# Altium schematic sheet Probe.SchDoc: JDH Productions Probe Board
size B; Author: JWH; DrawnBy: JWH; Engineer: JWH; Revision: 1; SheetNumber: 1; SheetTotal: 1
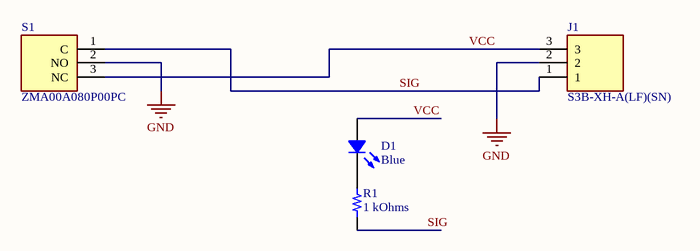
[diagram p0: Probe.SchDoc]

## Parts
D1  Blue  [LED 0805_2012 BLUE]
J1  S3B-XH-A(LF)(SN)  [JST_S3B-XH-A(LF)(SN)]
R1  1 kOhms  [RES 0805_2012]
S1  ZMA00A080P00PC  [ZMA00A080P00PC]

## Nets
GND: J1.2 S1.2(NO)
SIG: J1.1 R1.1 S1.1(C)
VCC: D1.1 J1.3 S1.3(NC)
NetD1_2: D1.2 R1.2

## Library data of the parts
D1 = 5990191007F: LED BLUE 0805 SMD; Manufacturer: Dialight; Configuration: Standard; Current - Test: 20mA; Lens Color: 0.80mm; Lens Size: 1.40mm x 1.25mm; Lens Style: Rectangle with Flat Top; Millicandela Rating: 105mcd; Viewing Angle: 140°; Voltage - Forward (Vf) (Typ): 3.2V; Wavelength - Dominant: 470nm; Part Number: 5990191007F; Color: Blue; ComponentLink1Description: Datasheet; ComponentLink1URL: http://www.dialightsignalsandcomponents.com/Assets/Brochures_And_Catalogs/Indication/CBI_SMD_new/Dialight_CBI_data_599-0805_Apr2018.pdf; ComponentLink2Description: DigiKey Link; ComponentLink2URL: https://www.digikey.com/en/products/detail/dialight/5990191007F/9385414; Device Package: 0805 (2012 Metric); Height (Max): 0.80mm; LastUpdated: 4/12/2022 10:51:43 PM; Lifecycle Status: Active; Minimum Order: 1; Mounting Type: Surface Mount; Package / Case: 0805 (2012 Metric); Packaging: TapeAndReel; PartId: 759; Part Status: Active; Price: 0.09; Series: 599; Size / Dimension: 2.00mm L x 1.25mm W; Supplier 1: DigiKey; Supplier Part Number 1: 350-4359-1-ND; Supplier Device Package: 0805; Value: Blue
J1 = S3B-XH-A(LF)(SN): Connector Header Through Hole, Right Angle 3 position 0.098" (2.50mm); MF: {'manufacturer': u'JST Sales America Inc.'}; Availability: Unavailable; MP: S3B-XH-A(LF)(SN); Value: *; Package: None; Price: None
R1 = RNCP0805FTD1K00: RES 1K OHM 1% 1/4W 0805; Manufacturer: Stackpole Electronics Inc; Power (Watts): 0.25W, 1/4W; Temperature Coefficient: ±100ppm/°C; Part Number: RNCP0805FTD1K00; Value: 1 kOhms; ComponentLink1Description: Datasheet; ComponentLink1URL: https://www.seielect.com/catalog/sei-rncp.pdf; ComponentLink2Description: DigiKey Link; ComponentLink2URL: https://www.digikey.com/en/products/detail/stackpole-electronics-inc/RNCP0805FTD1K00/2240229; Composition: Thin Film; Device Package: 0805 (2012 Metric); Features: Anti-Sulfur; Height - Seated (Max): 0.025" (0.65mm); LastUpdated: 4/12/2022 10:40:40 PM; Lifecycle Status: Active; Minimum Order: 1; Number of Terminations: 2; Operating Temperature: -55°C ~ 155°C; Package / Case: 0805 (2012 Metric); Packaging: TapeAndReel; PartId: 28023; Part Status: Active; Price: 0.01; Resistance: 1 kOhms; Series: RNCP; Size / Dimension: 0.079" L x 0.049" W (2.00mm x 1.25mm); Supplier 1: DigiKey; Supplier Part Number 1: RNCP0805FTD1K00CT-ND; Supplier Device Package: 0805; Tolerance: ±1%
S1 = ZMA00A080P00PC: Switch; Manufacturer_Name: C & K COMPONENTS; Datasheet Link: https://www.ckswitches.com/media/1372/zmasnap.pdf; Height: 7.35mm; Manufacturer_Part_Number: ZMA00A080P00PC